# EAGLE design Anode core (EAGLE 5.11)

## Sheet 1 of 2
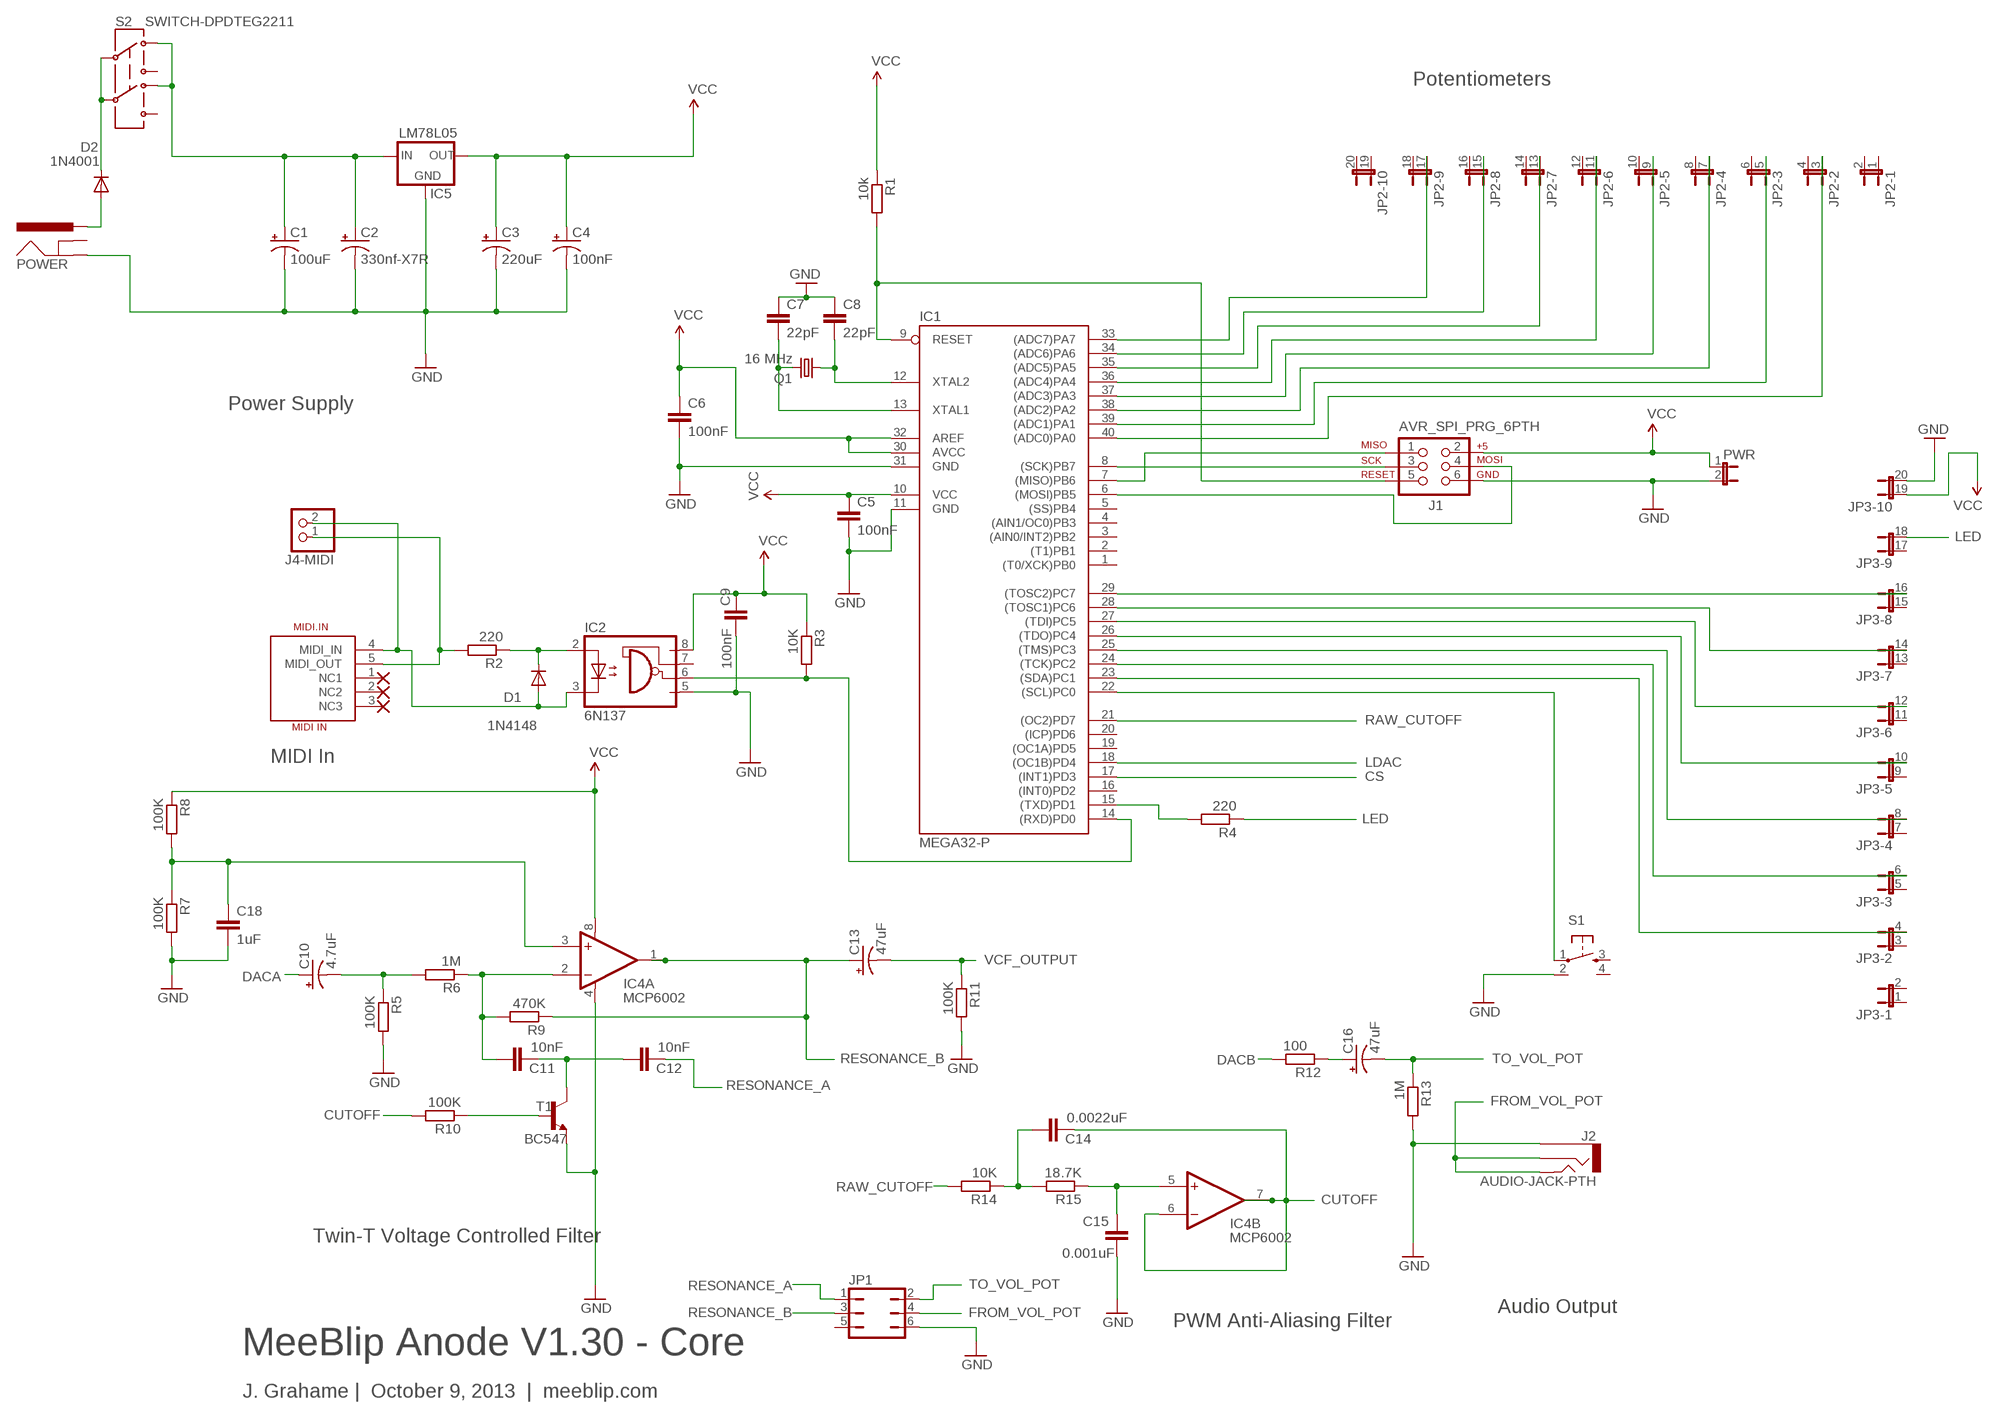
[diagram p0: schematic, sheet 1]

### Parts
C1  100uF  CAP_POLD  [PANASONIC_D]
C2  330nf-X7R  CAP_POLC  [PANASONIC_C]
C3  220uF  CAP_POLD  [PANASONIC_D]
C4  100nF  CAP_POLC  [PANASONIC_C]
C5  100nF  CAP0603-CAP  [0603-CAP]
C6  100nF  CAP0603-CAP  [0603-CAP]
C7  22pF  CAP0603-CAP  [0603-CAP]
C8  22pF  CAP0603-CAP  [0603-CAP]
C9  100nF  CAP0603-CAP  [0603-CAP]
C10  4.7uF  CAP_POLC  [PANASONIC_C]
C11  10nF  CAP0603-CAP  [0603-CAP]
C12  10nF  CAP0603-CAP  [0603-CAP]
C13  47uF  CAP_POLD  [PANASONIC_D]
C14  0.0022uF  CAP0603-CAP  [0603-CAP]
C15  0.001uF  CAP0603-CAP  [0603-CAP]
C16  47uF  CAP_POLD  [PANASONIC_D]
C18  1uF  CAP0603-CAP  [0603-CAP]
D1  1N4148  DIODE-SOD123  [SOD123]
D2  1N4001  DIODEPTH  [DIODE-1N4001]
IC1  MEGA32-P  [DIL40]
IC2  6N137  [DIL08]
IC4  MCP6002  [DIL08]
IC5  LM78L05  78LXX  [78LXX]
J1  AVR_SPI_PRG_6PTH  [2X3]
J2  AUDIO-JACK-PTH  [AUDIO-JACK]
J4-MIDI  PINHD-1X2  [1X02]
JP1  JP3Q  [JP3Q]
JP2  JP10QE  [JP10Q]
JP3  JP10QE  [JP10Q]
MIDI.IN  MIDI IN  MIDI_CONN_FEMALE_SUPPORT  [DIN_5_FEMALE_SUPPORT]
POWER  POWER_JACKPTH  [POWER_JACK_PTH]
PWR  JUMPER-2PTH  [1X02]
Q1  16 MHz  CRYSTALSMD  [HC49UP]
R1  10k  R-EU_M1206  [M1206]
R2  220  R-EU_M1206  [M1206]
R3  10K  R-EU_M1206  [M1206]
R4  220  R-EU_M1206  [M1206]
R5  100K  R-EU_M1206  [M1206]
R6  1M  R-EU_M1206  [M1206]
R7  100K  R-EU_M1206  [M1206]
R8  100K  R-EU_M1206  [M1206]
R9  470K  R-EU_M1206  [M1206]
R10  100K  R-EU_M1206  [M1206]
R11  100K  R-EU_M1206  [M1206]
R12  100  R-EU_M1206  [M1206]
R13  1M  R-EU_M1206  [M1206]
R14  10K  R-EU_M1206  [M1206]
R15  18.7K  R-EU_M1206  [M1206]
S1  TAC_SWITCHPTH  [TACTILE-PTH]
S2  SWITCH-DPDTEG2211  [EG2208A]
T1  BC547  [TO92]

### Nets
CS: IC1.17((INT1)PD3) ; also sheet 2
CUTOFF: C14.2 IC4.6(B:-IN) IC4.7(B:OUT) R10.2
DACA: C10.+ ; also sheet 2
DACB: R12.2 ; also sheet 2
FROM_VOL_POT: J2.2 J2.5 JP1.4
GND: C1.- C2.- C3.- C4.- C5.2 C6.2 C7.1 C8.1 C9.2 C15.2 C18.2 IC1.11(GND) IC1.31(GND) IC2.5(GND) IC4.4(A:V-) IC5.GND J1.6 J2.1 JP1.6 JP3.20 POWER.GND PWR.2 R5.2 R7.2 R11.2 R13.2 S1.2 T1.1(E) ; also sheet 2
LDAC: IC1.18((OC1B)PD4) ; also sheet 2
LED: JP3.18 R4.1
MIDI-RX: J4-MIDI.1 MIDI.IN.5(MIDI_OUT) R2.2
MOSI: IC1.6((MOSI)PB5) J1.4 ; also sheet 2
N$1: C8.2 IC1.12(XTAL2) Q1.1
N$2: C7.2 IC1.13(XTAL1) Q1.2
N$3: IC1.40((ADC0)PA0) JP2.3
N$5: IC1.7((MISO)PB6) J1.1
N$6: IC1.9(RESET) J1.5 R1.2
N$7: IC1.23((SDA)PC1) JP3.4
N$8: IC1.24((TCK)PC2) JP3.6
N$9: IC1.25((TMS)PC3) JP3.8
N$10: IC1.26((TDO)PC4) JP3.10
N$11: IC1.27((TDI)PC5) JP3.12
N$12: IC1.28((TOSC1)PC6) JP3.14
N$13: IC1.15((TXD)PD1) R4.2
N$14: IC1.29((TOSC2)PC7) JP3.16
N$15: IC1.39((ADC1)PA1) JP2.5
N$16: IC1.22((SCL)PC0) S1.1
N$17: IC1.38((ADC2)PA2) JP2.7
N$18: IC1.37((ADC3)PA3) JP2.9
N$19: IC1.36((ADC4)PA4) JP2.11
N$20: IC1.35((ADC5)PA5) JP2.13
N$21: C11.1 IC4.2(A:-IN) R6.1 R9.2
N$22: IC1.34((ADC6)PA6) JP2.15
N$23: IC1.33((ADC7)PA7) JP2.17
N$24: IC1.14((RXD)PD0) IC2.6(VO) R3.2
N$25: D2.A POWER.PWR
N$27: C1.+ C2.+ IC5.IN S2.P1-TA S2.P2-TA
N$32: D2.C S2.P1 S2.P2
N$34: C16.+ R12.1
N$37: C18.1 IC4.3(A:+IN) R7.1 R8.2
N$38: C10.- R5.1 R6.2
N$41: C11.2 C12.1 T1.3(C)
N$43: R10.1 T1.2(B)
N$45: D1.C IC2.2(A) R2.1
N$46: D1.A IC2.3(C) J4-MIDI.2 MIDI.IN.4(MIDI_IN)
N$73: C14.1 R14.1 R15.2
N$74: C15.1 IC4.5(B:+IN) R15.1
RAW_CUTOFF: IC1.21((OC2)PD7) R14.2
RESONANCE_A: C12.2 JP1.1
RESONANCE_B: C13.+ IC4.1(A:OUT) JP1.3 R9.1
SCK: IC1.8((SCK)PB7) J1.3 ; also sheet 2
TO_VOL_POT: C16.- JP1.2 R13.1
VCC: C3.+ C4.+ C5.1 C6.1 C9.1 IC1.10(VCC) IC1.30(AVCC) IC1.32(AREF) IC2.8(VCC) IC4.8(A:V+) IC5.OUT J1.2 JP3.19 PWR.1 R1.1 R3.1 R8.1 ; also sheet 2
VCF_OUTPUT: C13.- R11.1 ; also sheet 2
Unconnected: IC1.1((T0/XCK)PB0) IC1.2((T1)PB1) IC1.3((AIN0/INT2)PB2) IC1.4((AIN1/OC0)PB3) IC1.5((SS)PB4) IC1.16((INT0)PD2) IC1.19((OC1A)PD5) IC1.20((ICP)PD6) IC2.7(VE) JP1.5 JP2.1 JP2.2 JP2.4 JP2.6 JP2.8 JP2.10 JP2.12 JP2.14 JP2.16 JP2.18 JP2.19 JP2.20 JP3.1 JP3.2 JP3.3 JP3.5 JP3.7 JP3.9 JP3.11 JP3.13 JP3.15 JP3.17 MIDI.IN.1(NC1) MIDI.IN.2(NC2) MIDI.IN.3(NC3) POWER.GNDBREAK S1.3 S1.4 S2.P1-TB S2.P2-TB

### Notes on the sheet
- Potentiometers
- Power Supply
- MIDI In
- Twin-T Voltage Controlled Filter
- Audio Output
- PWM Anti-Aliasing Filter
- MeeBlip Anode V1.30 - Core
- J. Grahame |  October 9, 2013  |  meeblip.com

## Sheet 2 of 2
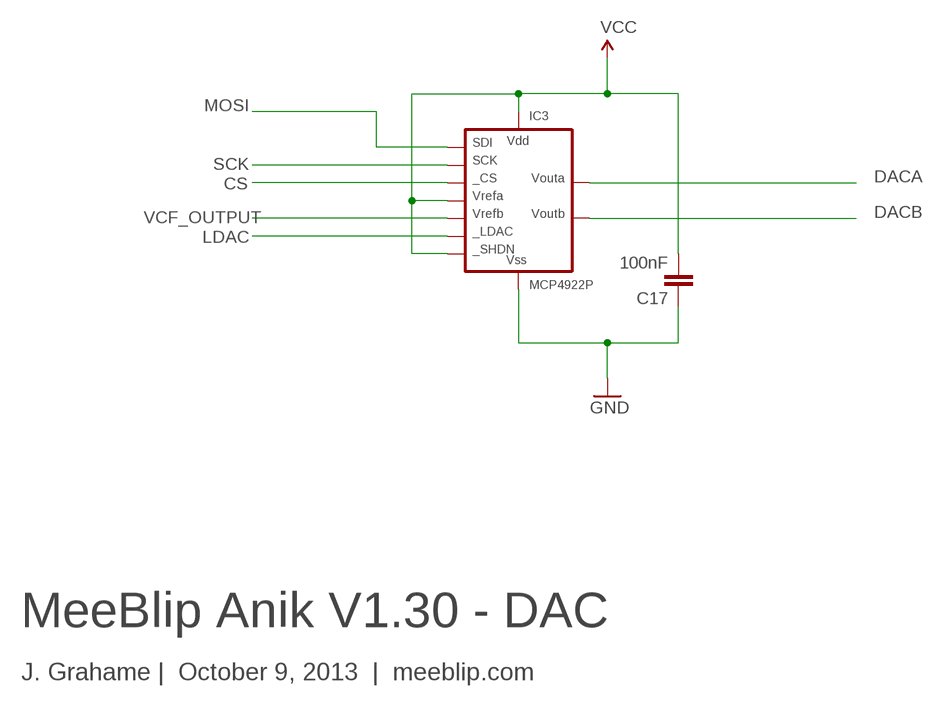
[diagram p1: schematic, sheet 2]

### Parts
C17  100nF  CAP0603-CAP  [0603-CAP]
IC3  MCP4922P  [DIL14]

### Nets
CS: IC3.3(CS) ; also sheet 1
DACA: IC3.14(VOUTA) ; also sheet 1
DACB: IC3.10(VOUTB) ; also sheet 1
GND: C17.1 IC3.12(VSS) ; also sheet 1
LDAC: IC3.8(LDAC) ; also sheet 1
MOSI: IC3.5(SDI) ; also sheet 1
SCK: IC3.4(SCK) ; also sheet 1
VCC: C17.2 IC3.1(VDD) IC3.9(SHDN) IC3.13(VREFA) ; also sheet 1
VCF_OUTPUT: IC3.11(VREFB) ; also sheet 1

### Notes on the sheet
- MeeBlip Anik V1.30 - DAC
- J. Grahame |  October 9, 2013  |  meeblip.com

## Library data of the parts
C1-C4 C10 C13 C16 = SparkFun:CAP_POL: Capacitor Polarized These are standard SMD and PTH capacitors. Normally 10uF, 47uF, and 100uF in electrolytic and tantalum varieties. Always verify the external diameter of the through hole cap, it varies with capacity, voltage, and manufacturer. The EIA devices should be standard.
C5-C9 C11 C12 C14 C15 C17 C18 = SparkFun:CAP: Capacitor Standard 0603 ceramic capacitor, and 0.1" leaded capacitor.
D1 = diode:DIODE-: DIODE
D2 = meeblip:DIODE: Diodes 1N4148 and 1N4001 power diodes.
IC1 = atmel:MEGA32-P: MICROCONTROLLER 32 Kbytes FLASH 2 Kbytes SRAM 1 Kbytes EEPROM USART 8-channel 10 bit ADC Source: www.atmel.com .. doc2503.pdf; MPN: ATMEGA32-16PU; OC_FARNELL: 1661729; OC_NEWARK: 51P1794
IC2 = optocoupler:6N137: MOTOROLA OPTO COUPLER; MPN: 6N137; OC_FARNELL: 1328376; OC_NEWARK: 52M1895
IC3 = microchip-dac:MCP4922: MCP4922: 12-bit DAC MCP4902/4912/4922 - 8/10/12-Bit Dual Voltage Output Digital-to-Analog Converter with SPI Interface The MCP49x2 devices are dual 8-bit, 10-bit, and 12-bit buffered voltage output Digital-to-Analog Converters (DACs), respectively. The devices operate from a single 2.7V to 5.5V supply with SPI compatible Serial Peripheral Interface. The user can configure the full-scale range of the device to be VREF or 2 * VREF by setting the Gain Selection Option bit (gain of 1 of 2). RobG
IC4 = meeblip:MCP6002: Dual Op Amp
IC5 = meeblip:78LXX: VOLTAGE REGULATOR Optional for use with 9 VDC power. Rated 100 mW.
J1 = meeblip:AVR_SPI_PRG_6: AVR ISP 6 Pin Smaller header for AVR programming. From SparkFun library.
J2 = meeblip:AUDIO-JACK: 3.5mm Audio Jack 3.5mm PCB mount audio jack. Sparkfun SKU: PRT-08032 (from SparkFun library)
J4-MIDI = meeblip:PINHD-1X2: PIN HEADER
JP1 = jumper:JP3Q: JUMPER
JP2 JP3 = jumper:JP10QE: JUMPER
MIDI.IN = Reflex:MIDI_CONN_FEMALE_SUPPORT
POWER = meeblip:POWER_JACK: Power Jack 5.5mm barrel jack for optional 9 VDC power input.
PWR = SparkFun:JUMPER-2: Jumper Basic 0.1" spaced jumper. Use with breakaway headers.
Q1 = SparkFun:CRYSTAL: Crystals Various standard crystals. Proven footprints. Spark Fun Electronics SKU : COM-00534
R1-R15 = rcl:R-EU_: RESISTOR, European symbol
S1 = SparkFun-mod:TAC_SWITCH: Momentary Switch Button commonly used for reset or general input. Spark Fun Electronics SKU : COM-00097
S2 = SparkFun-mod:SWITCH-DPDT: DPDT Version of the COM-00597
T1 = transistor:BC547: NPN TRANSISTOR

## Board
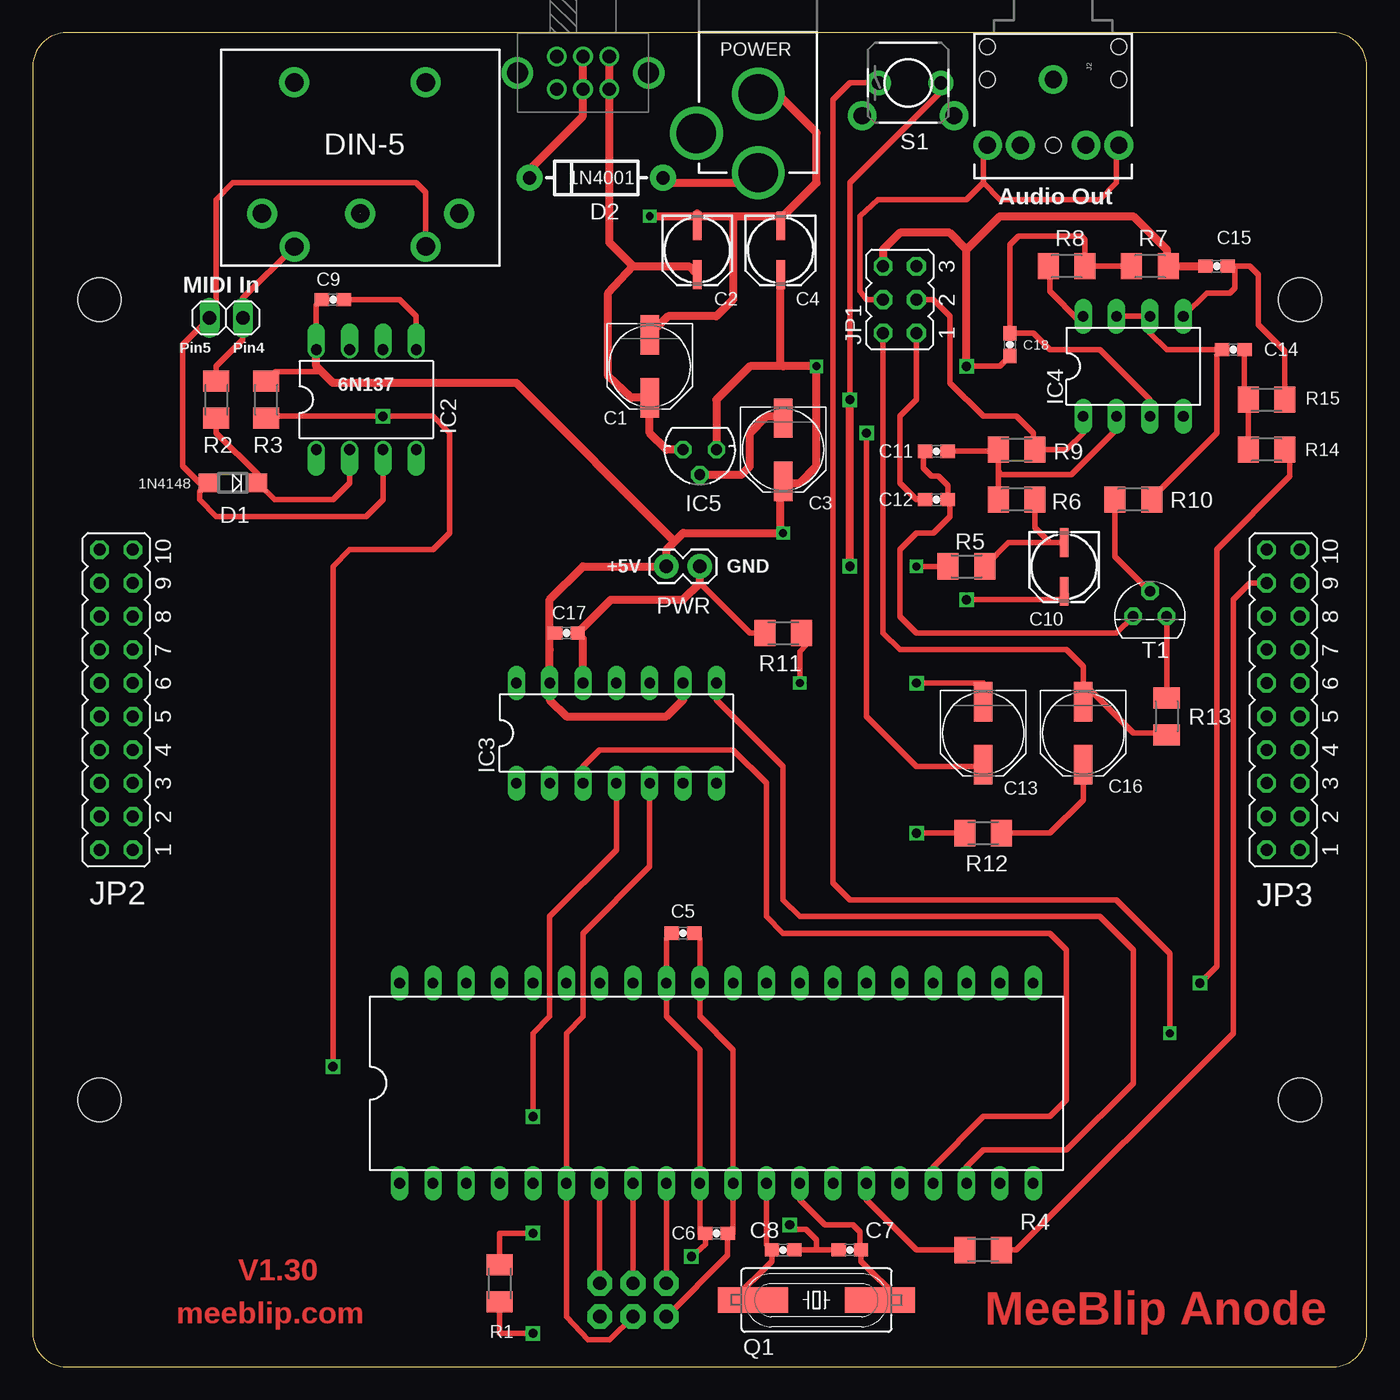
[diagram p2: board, top side]
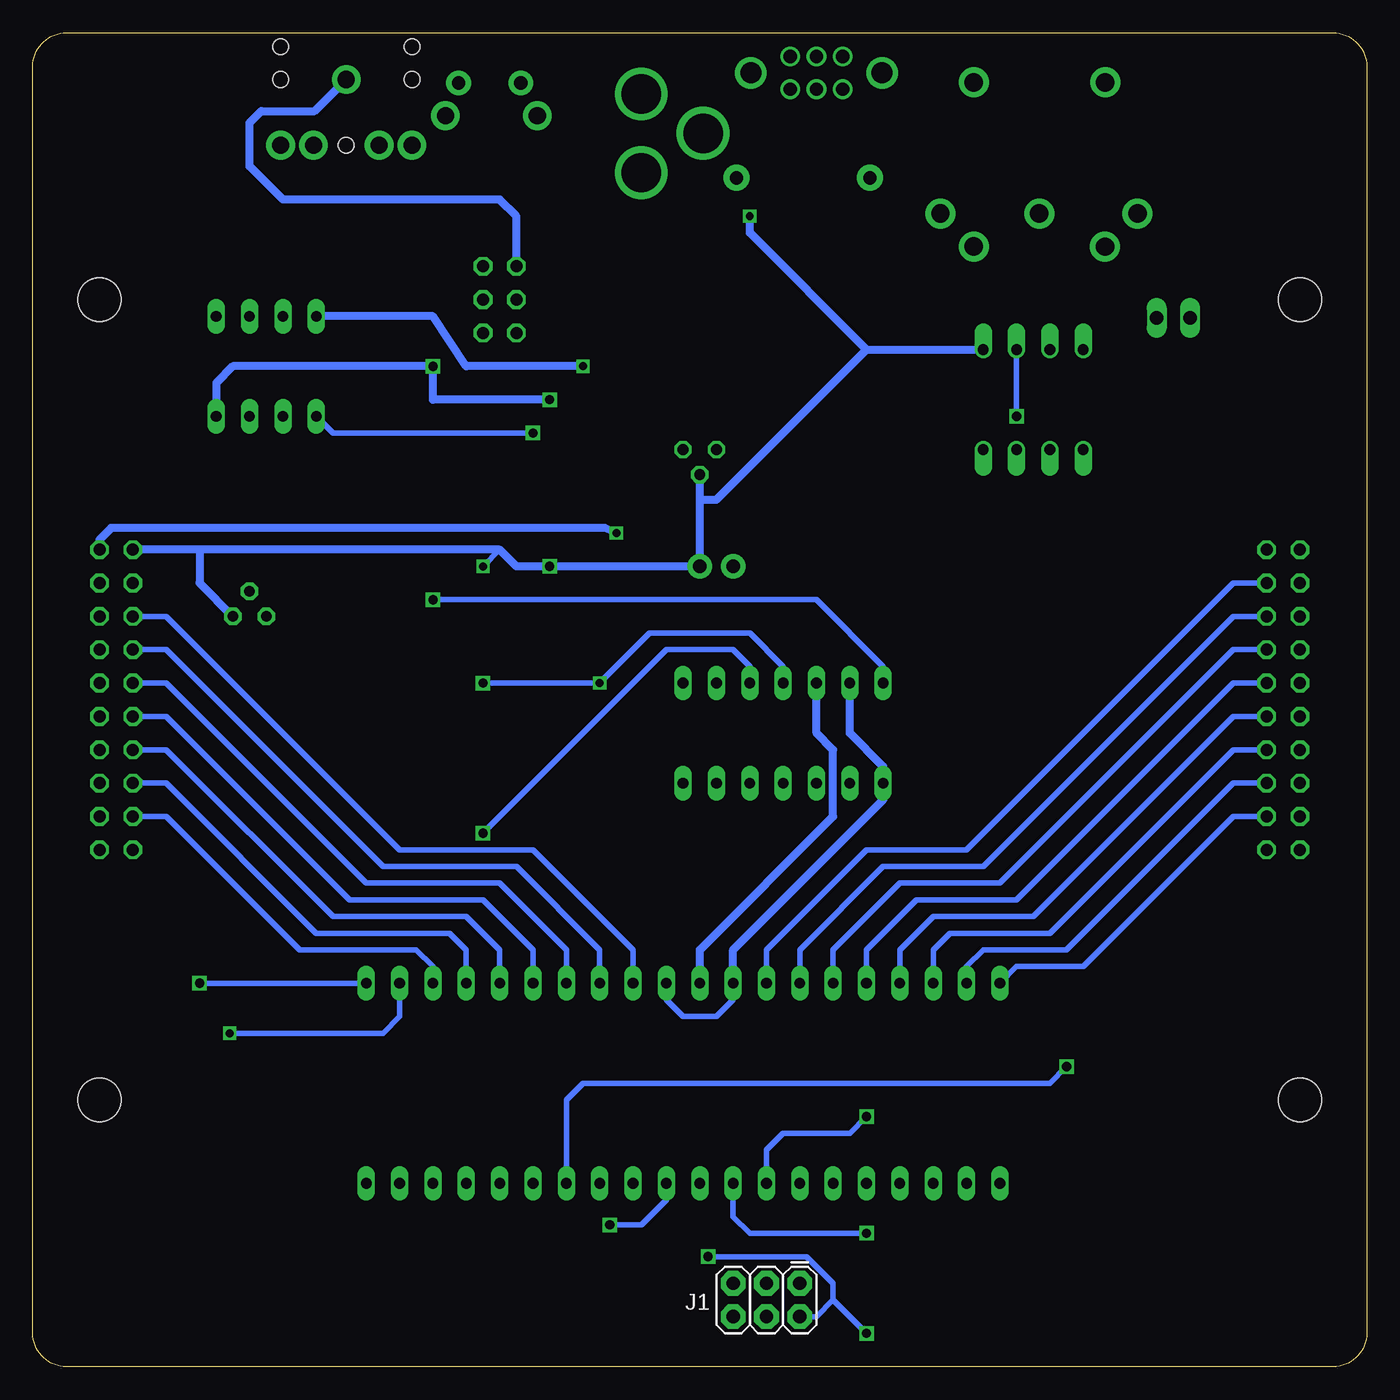
[diagram p3: board, bottom side, seen from below]

Size 101.6 x 101.6 mm. Coordinates in mm from the lower left corner, seen from the top.
Outline: 101.6,99.06 arc90 99.06,101.6 2.54,101.6 arc90 0,99.06 0,2.54 arc90 2.54,0 99.06,0 arc90 101.6,2.54 101.6,99.06
Copper layers (1*16): Top 0.035mm / dielectric 1.5mm / Bottom 0.035mm
Design rules "default": minimum track width 10mil, minimum drill 20mil, track to track 8mil, track to pad 8mil, pad to pad 8mil, via to via 8mil, smd to smd 8mil, copper to edge 40mil, drill to drill 8mil, minimum pad ring 10mil, minimum via ring 8mil, stop-mask expansion 4mil, vias tented up to drill 0mil, thermal gap 10mil

### Footprints (pad centres in the part's own frame; a part is rotated, then mirrored left to right if it is on the bottom)
PANASONIC_D = smd 3 x 1.4: + 2.4,0; - -2.4,0
PANASONIC_C = smd 2.2 x 0.65: + 1.9,-0.2; - -1.8,-0.2
0603-CAP = smd 1.1 x 1: 1 -0.85,0; 2 0.85,0
SOD123 = smd 1.4 x 1.4: A 1.9,0; C -1.9,0
DIODE-1N4001 = drill 1 pad 1.981 round: A -5.08,0; C 5.08,0
STAND-OFF = hole 3.302: 0,0
DIL40 = drill 0.813 long: 1 -24.13,-7.62; 2 -21.59,-7.62; 3 -19.05,-7.62; 4 -16.51,-7.62; 5 -13.97,-7.62; 6 -11.43,-7.62; 7 -8.89,-7.62; 8 -6.35,-7.62; 9 -3.81,-7.62; 10 -1.27,-7.62; 11 1.27,-7.62; 12 3.81,-7.62; 13 6.35,-7.62; 14 8.89,-7.62; 15 11.43,-7.62; 16 13.97,-7.62; 17 16.51,-7.62; 18 19.05,-7.62; 19 21.59,-7.62; 20 24.13,-7.62; 21 24.13,7.62; 22 21.59,7.62; 23 19.05,7.62; 24 16.51,7.62; 25 13.97,7.62; 26 11.43,7.62; 27 8.89,7.62; 28 6.35,7.62; 29 3.81,7.62; 30 1.27,7.62; 31 -1.27,7.62; 32 -3.81,7.62; 33 -6.35,7.62; 34 -8.89,7.62; 35 -11.43,7.62; 36 -13.97,7.62; 37 -16.51,7.62; 38 -19.05,7.62; 39 -21.59,7.62; 40 -24.13,7.62
DIL08 = drill 0.813 offset: 1 -3.81,-3.81; 2 -1.27,-3.81; 3 1.27,-3.81; 4 3.81,-3.81; 5 3.81,3.81; 6 1.27,3.81; 7 -1.27,3.81; 8 -3.81,3.81
DIL14 = drill 0.813 long: 1 -7.62,-3.81; 2 -5.08,-3.81; 3 -2.54,-3.81; 4 0,-3.81; 5 2.54,-3.81; 6 5.08,-3.81; 7 7.62,-3.81; 8 7.62,3.81; 9 5.08,3.81; 10 2.54,3.81; 11 0,3.81; 12 -2.54,3.81; 13 -5.08,3.81; 14 -7.62,3.81
DIL08' = drill 0.813 long: 1 -3.81,-3.81; 2 -1.27,-3.81; 3 1.27,-3.81; 4 3.81,-3.81; 5 3.81,3.81; 6 1.27,3.81; 7 -1.27,3.81; 8 -3.81,3.81
78LXX = drill 0.813 octagon: GND 0,1.905; IN 1.27,0; OUT -1.27,0
2X3 = drill 1.016 pad 1.88 octagon: 1 0,0; 2 0,2.54; 3 2.54,0; 4 2.54,2.54; 5 5.08,0; 6 5.08,2.54
AUDIO-JACK = drill 1.3 pad 2.184 round: 1 0,0; 2 5,5; 3 5,2.5; 4 5,-2.5; 5 5,-5 | hole 1.2: 0,5; -2.5,5; -2.5,-5; 0,-5; 5,0
1X02 = drill 1.016 long: 1 -1.27,0; 2 1.27,0
JP3Q = drill 0.914 octagon: 1 -2.54,-1.27; 2 -2.54,1.27; 3 0,-1.27; 4 0,1.27; 5 2.54,-1.27; 6 2.54,1.27
JP10Q = drill 0.914 octagon: 1 -11.43,-1.27; 2 -11.43,1.27; 3 -8.89,-1.27; 4 -8.89,1.27; 5 -6.35,-1.27; 6 -6.35,1.27; 7 -3.81,-1.27; 8 -3.81,1.27; 9 -1.27,-1.27; 10 -1.27,1.27; 11 1.27,-1.27; 12 1.27,1.27; 13 3.81,-1.27; 14 3.81,1.27; 15 6.35,-1.27; 16 6.35,1.27; 17 8.89,-1.27; 18 8.89,1.27; 19 11.43,-1.27; 20 11.43,1.27
DIN_5_FEMALE_SUPPORT = drill 1.4 pad 2.286 round: 1 0.46,3.61; 2 -7.07,3.6; 3 7.94,3.6; 4 -4.53,6.12; 5 5.47,6.13; 6 -4.53,-6.382; 7 5.478,-6.382
POWER_JACK_PTH = drill 2.997 round: GND 0,7.7; GNDBREAK 4.7,10.7; PWR 0,13.7
1X02' = drill 1.016 pad 1.88 round: 1 0,0; 2 2.54,0
HC49UP = smd 5.334 x 1.93: 1 -4.826,0; 2 4.826,0
M1206 = smd 1.6 x 2: 1 -1.4,0; 2 1.4,0
TACTILE-PTH = drill 1.016 pad 1.88 round: 1 -2.25,0; 2 2.5,0 | drill 1.3 pad 2.184 round: 3 -3.5,-2.5; 4 3.5,-2.5
EG2208A = drill 1 round: P1 -1.25,0; P1-TA -1.25,2; P1-TB -1.25,-2; P2 1.25,0; P2-TA 1.25,2; P2-TB 1.25,-2 | drill 1.6 round: P$7 0,5; P$8 0,-5
TO92 = drill 0.813 octagon: 1 1.27,0; 2 0,1.905; 3 -1.27,0

### Placement (x,y rotation side)
C1  46.99,76.2 270 top
C2  50.8,85.09 270 top
C3  57.15,69.85 270 top
C4  57.15,85.09 270 top
C5  49.53,33.02 0 top
C6  52.07,10.16 0 top
C7  62.23,8.89 0 top
C8  57.15,8.89 180 top
C9  22.86,81.28 0 top
C10  78.74,60.96 270 top
C11  68.83,69.72 180 top
C12  68.83,66.04 180 top
C13  72.39,48.26 270 top
C14  91.44,77.47 180 top
C15  90.17,83.82 180 top
C16  80.01,48.26 270 top
C17  40.64,55.88 180 top
C18  74.42,77.85 270 top
D1  15.24,67.31 180 top
D2  42.93,90.55 180 top
H1  STAND-OFF  [STAND-OFF]  5.08,81.28 0 top
H2  STAND-OFF  [STAND-OFF]  96.52,81.28 0 top
H3  STAND-OFF  [STAND-OFF]  5.08,20.32 0 top
H4  STAND-OFF  [STAND-OFF]  96.52,20.32 0 top
IC1  52.07,21.59 0 top
IC2  25.4,73.66 0 top
IC3  44.45,48.26 0 top
IC4  MCP6002  [DIL08']  83.82,76.2 0 top
IC5  50.8,69.85 180 top
J1  43.18,6.35 180 bottom
J2  77.72,98.04 270 top
J4-MIDI  14.73,79.88 180 top
JP1  66.04,81.28 90 top
JP2  6.35,50.8 90 top
JP3  95.25,50.8 90 top
MIDI.IN  25.4,91.44 180 top
POWER  55.24,104.65 180 top
PWR  [1X02']  48.26,60.96 0 top
Q1  59.69,5.08 0 top
R1  35.56,6.35 90 top
R2  13.97,73.66 90 top
R3  17.78,73.66 270 top
R4  72.39,8.89 180 top
R5  71.12,60.96 180 top
R6  74.93,66.04 0 top
R7  85.09,83.82 0 top
R8  78.74,83.82 0 top
R9  74.93,69.85 180 top
R10  83.82,66.04 0 top
R11  57.15,55.88 180 top
R12  72.39,40.64 180 top
R13  86.36,49.53 90 top
R14  93.98,69.85 0 top
R15  93.98,73.66 180 top
S1  66.67,97.79 0 top
S2  41.91,98.55 270 top
T1  85.09,57.15 0 top

### Tracks (layer width: path | path; a pad name or v marks a point on that pad's centre or on a via)
CS
  Top 0.406: IC1.17 68.58,15.24 72.39,19.05 77.47,19.05 78.74,20.32 78.74,31.75 77.47,33.02 57.15,33.02 55.88,34.29 55.88,44.45 53.34,46.99 43.18,46.99 41.91,45.72 IC3.3
CUTOFF
  Top 0.406: R10.2 85.22,66.17 90.17,71.12 90.17,77.05 C14.2 86.36,77.47 85.09,78.74 IC4.6 IC4.7
DACA  (via drill 0.7)
  Top 0.406: v71.12,58.42 78.74,58.42 78.74,58.86 C10.+
  Bottom 0.406: IC3.14 36.83,53.34 41.91,58.42 v71.12,58.42
DACB  (via drill 0.7)
  Top 0.406: v67.31,40.64 R12.2
  Bottom 0.406: IC3.10 46.99,53.34 48.26,54.61 53.34,54.61 v67.31,40.64
FROM_VOL_POT
  Top 0.406: JP1.4 63.5,81.28 62.99,81.92 62.99,87.63 64.39,88.9 71.12,88.9 72.39,90.17 | 72.39,90.17 73.66,88.9 81.28,88.9 82.55,90.17 82.55,92.87 J2.2 | 72.39,90.17 72.39,92.71 J2.5
GND  (via drill 0.6, 0.7)
  Top 0.406: C5.2 50.8,32.6 IC1.31 50.8,26.67 53.34,24.13 IC1.11 53.34,10.16 C6.2 52.92,8.47 J1.6 | 59.69,8.89 C8.1 | 59.69,8.89 C7.1 | 59.69,8.89 59.69,9.65 58.89,10.45 58,10.45 v57.66,10.79 | 41.91,55.46 C17.1 | IC2.5 29.21,80.01 27.94,81.28 C9.2 | v62.23,73.66 62.23,90.17 69.17,97.11 S1.2 | v67.31,60.96 R5.2 | C18.2 74.42,76.96 73.66,76.2 v71.12,76.2 | 50.8,59.69 54.61,55.88 R11.2 | T1.1 R13.2
  Top 0.61: C2.- 50.6,87.43 50.8,87.63 | C4.- 56.95,87.43 57.15,87.63 | 50.8,87.63 53.34,87.63 | 53.34,87.63 53.34,81.28 52.07,80.01 48.4,80.01 C1.- | 50.8,87.63 50.6,87.83 | IC3.12 41.91,55.46 | v62.23,60.96 v62.23,73.66 | JP1.6 64.77,85.09 66.04,86.36 69.85,86.36 71.12,85.09 | v71.12,76.2 71.12,85.09 | 71.12,85.09 73.66,87.63 83.82,87.63 86.36,85.09 86.36,83.95 R7.2 C15.2 | POWER.GND 56.72,96.95 59.69,93.98 59.69,90.17 57.15,87.63 | 53.34,87.63 57.15,87.63 | v46.99,87.63 50.8,87.63 | PWR.2 50.8,59.69 49.53,58.42 44.03,58.42 C17.1 | IC5.GND 53.98,67.94 54.61,68.58 54.61,71.12 55.88,72.39 57.01,72.39 C3.-
  Bottom 0.406: v57.66,10.79 55.24,10.79 53.34,12.7 IC1.11 | 66.04,62.23 v67.31,60.96
  Bottom 0.61: 88.9,62.23 66.04,62.23 64.77,60.96 v62.23,60.96 PWR.2 | 88.9,62.23 JP3.20 | IC3.12 41.91,48.26 40.64,46.99 40.64,41.91 50.8,31.75 IC1.31 | v62.23,73.66 71.12,73.66 v71.12,76.2 86.36,76.2 87.63,74.93 IC4.4 | JP1.6 64.77,87.63 66.04,88.9 82.55,88.9 85.09,91.44 85.09,94.74 84.2,95.63 80.14,95.63 J2.1 | PWR.2 50.8,66.04 | 50.8,66.04 IC5.GND | PWR.2 50.8,62.23 | 38.1,77.47 IC2.5 | 38.1,77.47 49.53,66.04 50.8,66.04 | v46.99,87.63 46.99,86.36 38.1,77.47 | T1.1 88.9,59.69 88.9,62.23
LDAC
  Top 0.406: IC1.18 71.12,15.24 72.39,16.51 78.74,16.51 83.82,21.59 83.82,31.75 81.28,34.29 58.42,34.29 57.15,35.56 57.15,45.72 52.07,50.8 IC3.8
LED
  Top 0.406: JP3.18 92.71,59.69 91.44,58.42 91.44,25.4 74.93,8.89 R4.1 73.53,8.89
MIDI-RX
  Top 0.406: MIDI.IN.5 16,81.38 J4-MIDI.1 16,78.23 13.97,76.2 R2.2
MOSI
  Top 0.406: J1.4 43.94,2.03 42.29,2.03 40.64,3.81 IC1.6 40.64,25.4 41.91,26.67 41.91,33.02 46.99,38.1 IC3.5
N$1
  Top 0.406: IC1.12 55.88,9.31 C8.2 56.3,8.04 53.34,5.08 Q1.1
N$2
  Top 0.406: IC1.13 58.42,12.7 60.33,10.79 62.48,10.79 62.99,10.29 62.99,8.98 C7.2 63.08,8.04 66.04,5.08 Q1.2 63.5,5.08
N$3
  Bottom 0.406: JP2.3 10.16,41.91 21.59,30.48 26.67,30.48 IC1.40
N$5
  Top 0.406: J1.1 IC1.7
N$6  (via drill 0.7)
  Top 0.406: IC1.9 J1.5 | R1.2 35.56,10.16 v38.1,10.16
  Bottom 0.406: v38.1,10.16 46.99,10.16 48.26,11.43 IC1.9
N$7
  Bottom 0.406: IC1.23 71.12,30.48 72.39,31.75 81.28,31.75 91.44,41.91 JP3.4
N$8
  Bottom 0.406: IC1.24 68.58,31.75 69.85,33.02 80.01,33.02 91.44,44.45 JP3.6
N$9
  Bottom 0.406: IC1.25 66.04,31.75 68.58,34.29 78.74,34.29 91.44,46.99 JP3.8
N$10
  Bottom 0.406: IC1.26 63.5,31.75 67.31,35.56 77.47,35.56 91.44,49.53 JP3.10
N$11
  Bottom 0.406: JP3.12 91.44,52.07 76.2,36.83 66.04,36.83 60.96,31.75 IC1.27
N$12
  Bottom 0.406: IC1.28 58.42,31.75 64.77,38.1 74.93,38.1 91.44,54.61 JP3.14
N$13
  Top 0.406: IC1.15 63.5,12.7 67.31,8.89 R4.2
N$14
  Bottom 0.406: JP3.16 91.44,57.15 73.66,39.37 63.5,39.37 55.88,31.75 IC1.29
N$15
  Bottom 0.406: JP2.5 10.16,44.45 22.86,31.75 29.21,31.75 30.48,30.48 IC1.39
N$16  (via drill 0.6)
  Top 0.406: S1.1 62.23,97.79 60.96,96.52 60.96,36.83 62.23,35.56 82.55,35.56 86.61,31.5 v86.61,25.4
  Bottom 0.406: IC1.22 73.66,26.67 74.93,25.4 v86.61,25.4
N$17
  Bottom 0.406: JP2.7 10.16,46.99 24.13,33.02 31.75,33.02 33.02,31.75 IC1.38
N$18
  Bottom 0.406: JP2.9 10.16,49.53 25.4,34.29 33.02,34.29 35.56,31.75 IC1.37
N$19
  Bottom 0.406: JP2.11 10.16,52.07 26.67,35.56 34.29,35.56 38.1,31.75 IC1.36
N$20
  Bottom 0.406: IC1.35 40.64,31.75 35.56,36.83 27.94,36.83 10.16,54.61 JP2.13
N$21
  Top 0.406: 73.53,68.2 R9.2 73.4,69.72 C11.1 | 73.53,68.2 R6.1 | IC4.2 82.55,71.37 79.12,67.94 73.78,67.94 73.53,68.2
N$22
  Bottom 0.406: IC1.34 43.18,31.75 36.83,38.1 29.21,38.1 10.16,57.15 JP2.15
N$23
  Bottom 0.406: IC1.33 45.72,31.75 38.1,39.37 30.48,39.37 10.16,59.69 JP2.17
N$24  (via drill 0.7)
  Top 0.406: v22.86,22.86 22.86,60.96 24.13,62.23 30.48,62.23 31.75,63.5 31.75,71.12 30.48,72.39 v26.67,72.39 17.91,72.39 R3.2
  Bottom 0.406: IC1.14 60.96,20.32 59.69,21.59 24.13,21.59 v22.86,22.86 | v26.67,72.39 IC2.6
N$25
  Top 0.61: POWER.PWR 54.47,90.17 48.26,90.17 48.01,90.42 D2.A
N$27
  Top 0.61: 45.72,83.82 43.91,85.63 S2.P2-TA S2.P1-TA | 45.72,83.82 49.97,83.82 C2.+ | IC5.IN 48.26,69.85 46.99,71.12 C1.+ 45.58,73.8 43.81,75.44 43.81,81.79 45.72,83.82
N$32
  Top 0.61: D2.C 37.85,91.19 41.91,95.25 S2.P2 S2.P1
N$34
  Top 0.406: R12.1 77.47,40.64 80.01,43.18 C16.+
N$37
  Top 0.406: R8.2 R7.1 | R8.2 80.01,83.69 | IC4.3 85.09,73.66 81.28,77.47 77.47,77.47 76.2,78.74 74.46,78.74 C18.1 74.42,85.47 75.06,86.11 79.88,86.11 80.14,85.85 R8.2
N$38
  Top 0.406: 77.47,62.76 74.32,62.76 R5.1 | 77.47,62.76 C10.- | R6.2 76.33,63.9 77.47,62.76
N$41
  Top 0.406: C11.2 67.82,69.56 67.82,68.45 68.45,67.82 68.96,67.82 69.68,67.09 C12.1 69.85,65.62 69.85,64.77 68.58,63.5 67.31,63.5 66.04,62.23 66.04,57.15 67.31,55.88 82.55,55.88 T1.3
N$43
  Top 0.406: R10.1 82.42,61.73 T1.2
N$45
  Top 0.406: IC2.2 24.13,67.31 22.86,66.04 18.41,66.04 D1.C 17.14,67.94 13.97,71.12 R2.1
N$46
  Top 0.406: IC2.3 26.67,66.04 25.4,64.77 13.97,64.77 12.7,66.04 12.7,66.67 D1.A 12.7,67.31 11.43,68.58 11.43,77.85 J4-MIDI.2 13.97,80.39 13.97,88.9 15.24,90.17 29.21,90.17 29.93,89.45 MIDI.IN.4
N$73
  Top 0.406: R14.1 R15.2 92.29,73.95 C14.1
N$74
  Top 0.406: 91.57,83.82 92.71,83.82 93.34,83.19 93.34,79.38 95.38,77.34 R15.1 | 91.57,83.82 C15.1 | IC4.5 89.41,81.79 91.19,81.79 91.57,82.17 91.57,83.82
RAW_CUTOFF  (via drill 0.7)
  Top 0.406: v88.9,29.21 90.17,30.48 90.17,62.23 95.76,67.82 95.76,69.47 R14.2
  Bottom 0.406: IC1.21 v88.9,29.21
RESONANCE_A
  Top 0.406: JP1.1 67.31,73.66 66.04,72.39 66.04,67.31 67.31,66.04 C12.2
RESONANCE_B  (via drill 0.7)
  Top 0.406: IC4.1 80.01,71.12 78.74,69.85 R9.1 76.2,69.98 76.2,71.12 74.93,72.39 72.39,72.39 69.85,74.93 69.85,80.01 68.58,81.28 JP1.3 | v63.5,71.12 63.5,49.53 67.31,45.72 72.25,45.72 C13.+
  Bottom 0.406: v63.5,71.12 78.74,71.12 IC4.1
SCK  (via drill 0.7)
  Top 0.406: J1.3 IC1.8 | v38.1,19.05 38.1,25.4 39.37,26.67 39.37,34.29 44.45,39.37 IC3.4
  Bottom 0.406: IC1.8 45.72,16.51 44.45,17.78 39.37,17.78 v38.1,19.05
TO_VOL_POT
  Top 0.406: JP1.2 64.77,55.88 66.04,54.61 78.74,54.61 80.01,53.34 80.01,52.07 | 80.01,52.07 C16.- | 80.01,52.07 83.82,48.26 86.23,48.26 R13.1
VCC  (via drill 0.6, 0.7)
  Top 0.406: C5.1 48.26,32.6 IC1.32 48.26,26.67 50.8,24.13 IC1.10 50.8,10.16 C6.1 51.22,9.31 v50.16,8.38 | R1.1 35.56,2.54 v38.1,2.54 | 39.37,54.61 39.37,55.46 C17.2 | 22.01,75.78 18.5,75.78 R3.1 | IC2.8 21.59,80.86 C9.1 | R8.1 77.47,83.69 77.47,81.91 79.69,79.69 IC4.8
  Top 0.61: C4.+ 56.95,76.4 57.15,76.2 | C3.+ 57.59,67.31 58.42,67.31 59.69,68.58 v59.69,76.2 57.15,76.2 | C3.+ 57.15,67.75 | IC2.8 21.59,76.2 22.01,75.78 22.86,74.93 36.83,74.93 48.9,62.87 | IC3.9 49.53,50.8 48.26,49.53 40.64,49.53 39.37,50.8 IC3.13 39.37,54.61 39.37,58.42 41.91,60.96 PWR.1 48.26,62.23 48.9,62.87 | C3.+ 56.95,67.11 56.95,63.7 v57.15,63.5 49.53,63.5 48.9,62.87 | IC5.OUT 52.07,73.66 54.61,76.2 57.15,76.2
  Bottom 0.406: IC1.30 53.34,27.94 52.07,26.67 49.53,26.67 48.26,27.94 IC1.32 | v50.16,8.38 42.67,8.38 40.64,6.35 40.64,5.08 | 40.64,5.08 41.91,3.81 J1.2 | v38.1,2.54 40.64,5.08 | IC3.1 36.83,45.72
  Bottom 0.61: JP3.19 96.52,62.99 95.63,63.88 58.04,63.88 v57.15,63.5 | IC3.13 39.37,48.26 36.83,45.72 | IC3.1 36.83,43.18 48.26,31.75 IC1.32 | IC4.8 71.12,80.01 68.58,76.2 v59.69,76.2
VCF_OUTPUT  (via drill 0.6, 0.7)
  Top 0.406: v67.31,52.07 72.39,52.07 C13.- | v58.42,52.07 58.42,54.48 58.93,54.99 58.93,55.5 R11.1
  Bottom 0.406: IC3.11 44.45,53.34 46.99,55.88 54.61,55.88 v58.42,52.07 v67.31,52.07

### Text on the board
Top: V1.30 | MeeBlip Anode | meeblip.com
tNames: Audio Out | MIDI In | Pin5 | Pin4 | 6N137 | +5V | GND